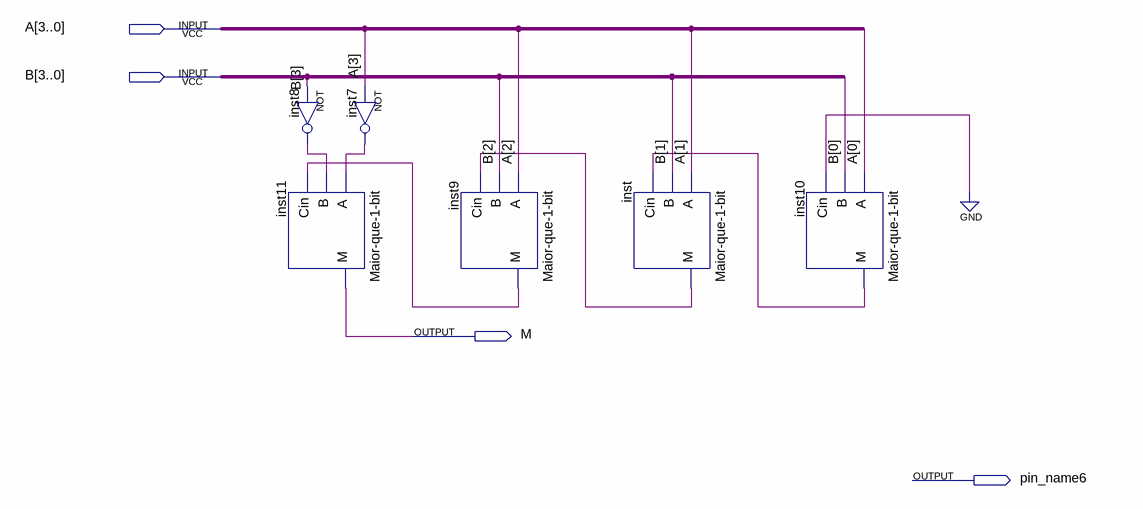
[diagram p0: schematic sheet]
// Quartus schematic Maior-que-4-bits.bdf as structural Verilog: 6 symbols, 4 pins
module \Maior-que-4-bits  (
  input  [3:0] A,
  input  [3:0] B,
  output M,
  output pin_name6
);

  wire inst7_out, inst8_out, inst9_m, inst10_m, inst_m;

  not inst8 (inst8_out, B[3]);
  \Maior-que-1-bit  inst11 (.A(inst7_out), .B(inst8_out), .Cin(inst9_m), .M(M));
  not inst7 (inst7_out, A[3]);
  \Maior-que-1-bit  inst9 (.A(A[2]), .B(B[2]), .Cin(inst_m), .M(inst9_m));
  \Maior-que-1-bit  inst (.A(A[1]), .B(B[1]), .Cin(inst10_m), .M(inst_m));
  \Maior-que-1-bit  inst10 (.A(A[0]), .B(B[0]), .Cin(1'b0), .M(inst10_m));
endmodule
